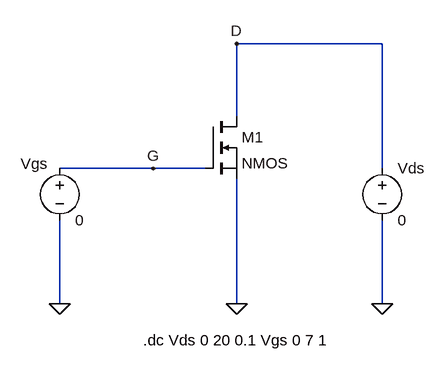
[diagram p0: schematic Task02.asc]
Task02.asc, the LTspice schematic file:
Version 4
SHEET 1 880 680
WIRE 480 -48 256 -48
WIRE 256 64 256 -48
WIRE 128 144 -16 144
WIRE 208 144 128 144
WIRE 480 144 480 -48
WIRE -16 352 -16 224
WIRE 256 352 256 160
WIRE 480 352 480 224
FLAG -16 352 0
FLAG 256 352 0
FLAG 480 352 0
FLAG 128 144 G
FLAG 256 -48 D
SYMBOL voltage -16 128 R0
WINDOW 0 -60 9 Left 2
SYMATTR InstName Vgs
SYMATTR Value 0
SYMBOL voltage 480 128 R0
SYMATTR InstName Vds
SYMATTR Value 0
SYMBOL nmos 208 64 R0
SYMATTR InstName M1
TEXT 112 408 Left 2 !.dc Vds 0 20 0.1 Vgs 0 7 1

The netlist it stands for:
* Task02.asc
Vgs G 0 0
Vds D 0 0
M1 D G 0 0 NMOS
.model NMOS NMOS
.model PMOS PMOS
.lib standard.mos
.dc Vds 0 20 0.1 Vgs 0 7 1
.backanno
.end